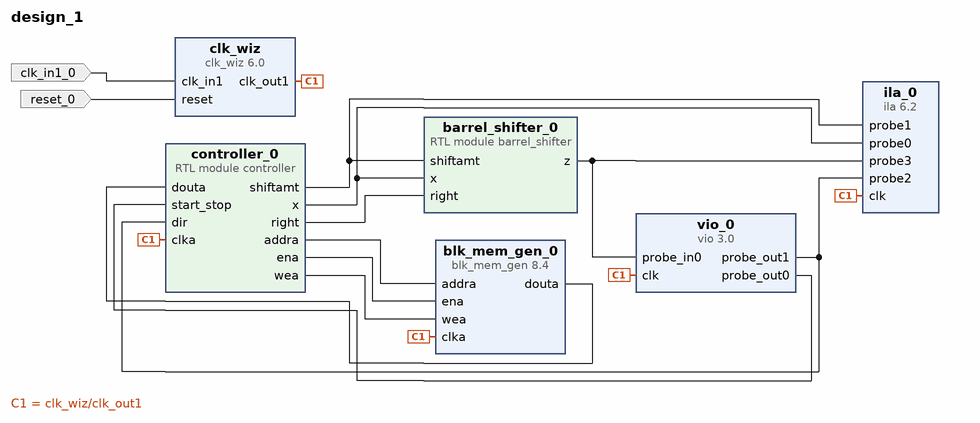
[diagram p0: block diagram of the top level]
# Vivado block design design_1, xc7z020clg400-1, Vivado 2020.2
create_bd_design design_1

create_bd_port -dir I -type clk clk_in1_0
create_bd_port -dir I -type rst reset_0
set_property -dict {CONFIG.POLARITY ACTIVE_HIGH} [get_bd_ports reset_0]

create_bd_cell -type ip -vlnv xilinx.com:ip:blk_mem_gen:8.4 blk_mem_gen_0
set_property -dict [list \
  CONFIG.Coe_File c:/Users/sbmur/Downloads/barrshifter.coe \
  CONFIG.Enable_32bit_Address false \
  CONFIG.Load_Init_File true \
  CONFIG.Read_Width_A 11 \
  CONFIG.Register_PortA_Output_of_Memory_Primitives true \
  CONFIG.Use_Byte_Write_Enable false \
  CONFIG.Use_RSTA_Pin false \
  CONFIG.Write_Depth_A 8 \
  CONFIG.Write_Width_A 11 \
  CONFIG.use_bram_block Stand_Alone \
] [get_bd_cells blk_mem_gen_0]
create_bd_cell -type module -reference barrel_shifter barrel_shifter_0
create_bd_cell -type ip -vlnv xilinx.com:ip:ila:6.2 ila_0
set_property -dict [list \
  CONFIG.C_ENABLE_ILA_AXI_MON false \
  CONFIG.C_MONITOR_TYPE Native \
  CONFIG.C_NUM_OF_PROBES 4 \
  CONFIG.C_PROBE0_WIDTH 8 \
  CONFIG.C_PROBE1_WIDTH 3 \
  CONFIG.C_PROBE3_WIDTH 8 \
] [get_bd_cells ila_0]
create_bd_cell -type ip -vlnv xilinx.com:ip:vio:3.0 vio_0
set_property -dict {CONFIG.C_NUM_PROBE_OUT 2} [get_bd_cells vio_0]
create_bd_cell -type ip -vlnv xilinx.com:ip:clk_wiz:6.0 clk_wiz
create_bd_cell -type module -reference controller controller_0

# ---- connections ----

connect_bd_net [get_bd_pins controller_0/shiftamt] [get_bd_pins barrel_shifter_0/shiftamt] [get_bd_pins ila_0/probe1]
connect_bd_net [get_bd_pins controller_0/x] [get_bd_pins barrel_shifter_0/x] [get_bd_pins ila_0/probe0]
connect_bd_net [get_bd_pins controller_0/addra] [get_bd_pins blk_mem_gen_0/addra]
connect_bd_net [get_bd_pins controller_0/ena] [get_bd_pins blk_mem_gen_0/ena]
connect_bd_net [get_bd_pins barrel_shifter_0/z] [get_bd_pins ila_0/probe3] [get_bd_pins vio_0/probe_in0]
connect_bd_net [get_bd_pins controller_0/right] [get_bd_pins barrel_shifter_0/right]
connect_bd_net [get_bd_pins blk_mem_gen_0/douta] [get_bd_pins controller_0/douta]
connect_bd_net [get_bd_pins vio_0/probe_out0] [get_bd_pins controller_0/start_stop]
connect_bd_net [get_bd_pins vio_0/probe_out1] [get_bd_pins controller_0/dir] [get_bd_pins ila_0/probe2]
connect_bd_net [get_bd_pins controller_0/wea] [get_bd_pins blk_mem_gen_0/wea]
connect_bd_net [get_bd_pins clk_wiz/clk_out1] \
  [get_bd_pins ila_0/clk] [get_bd_pins vio_0/clk] [get_bd_pins blk_mem_gen_0/clka] [get_bd_pins controller_0/clka]
connect_bd_net -net clk_in1_0_1 [get_bd_ports clk_in1_0] [get_bd_pins clk_wiz/clk_in1]
connect_bd_net -net reset_0_1 [get_bd_ports reset_0] [get_bd_pins clk_wiz/reset]

validate_bd_design
save_bd_design
